# EAGLE design board (EAGLE 9.5.2)

## Sheet 1 of 4: MCU and Motors
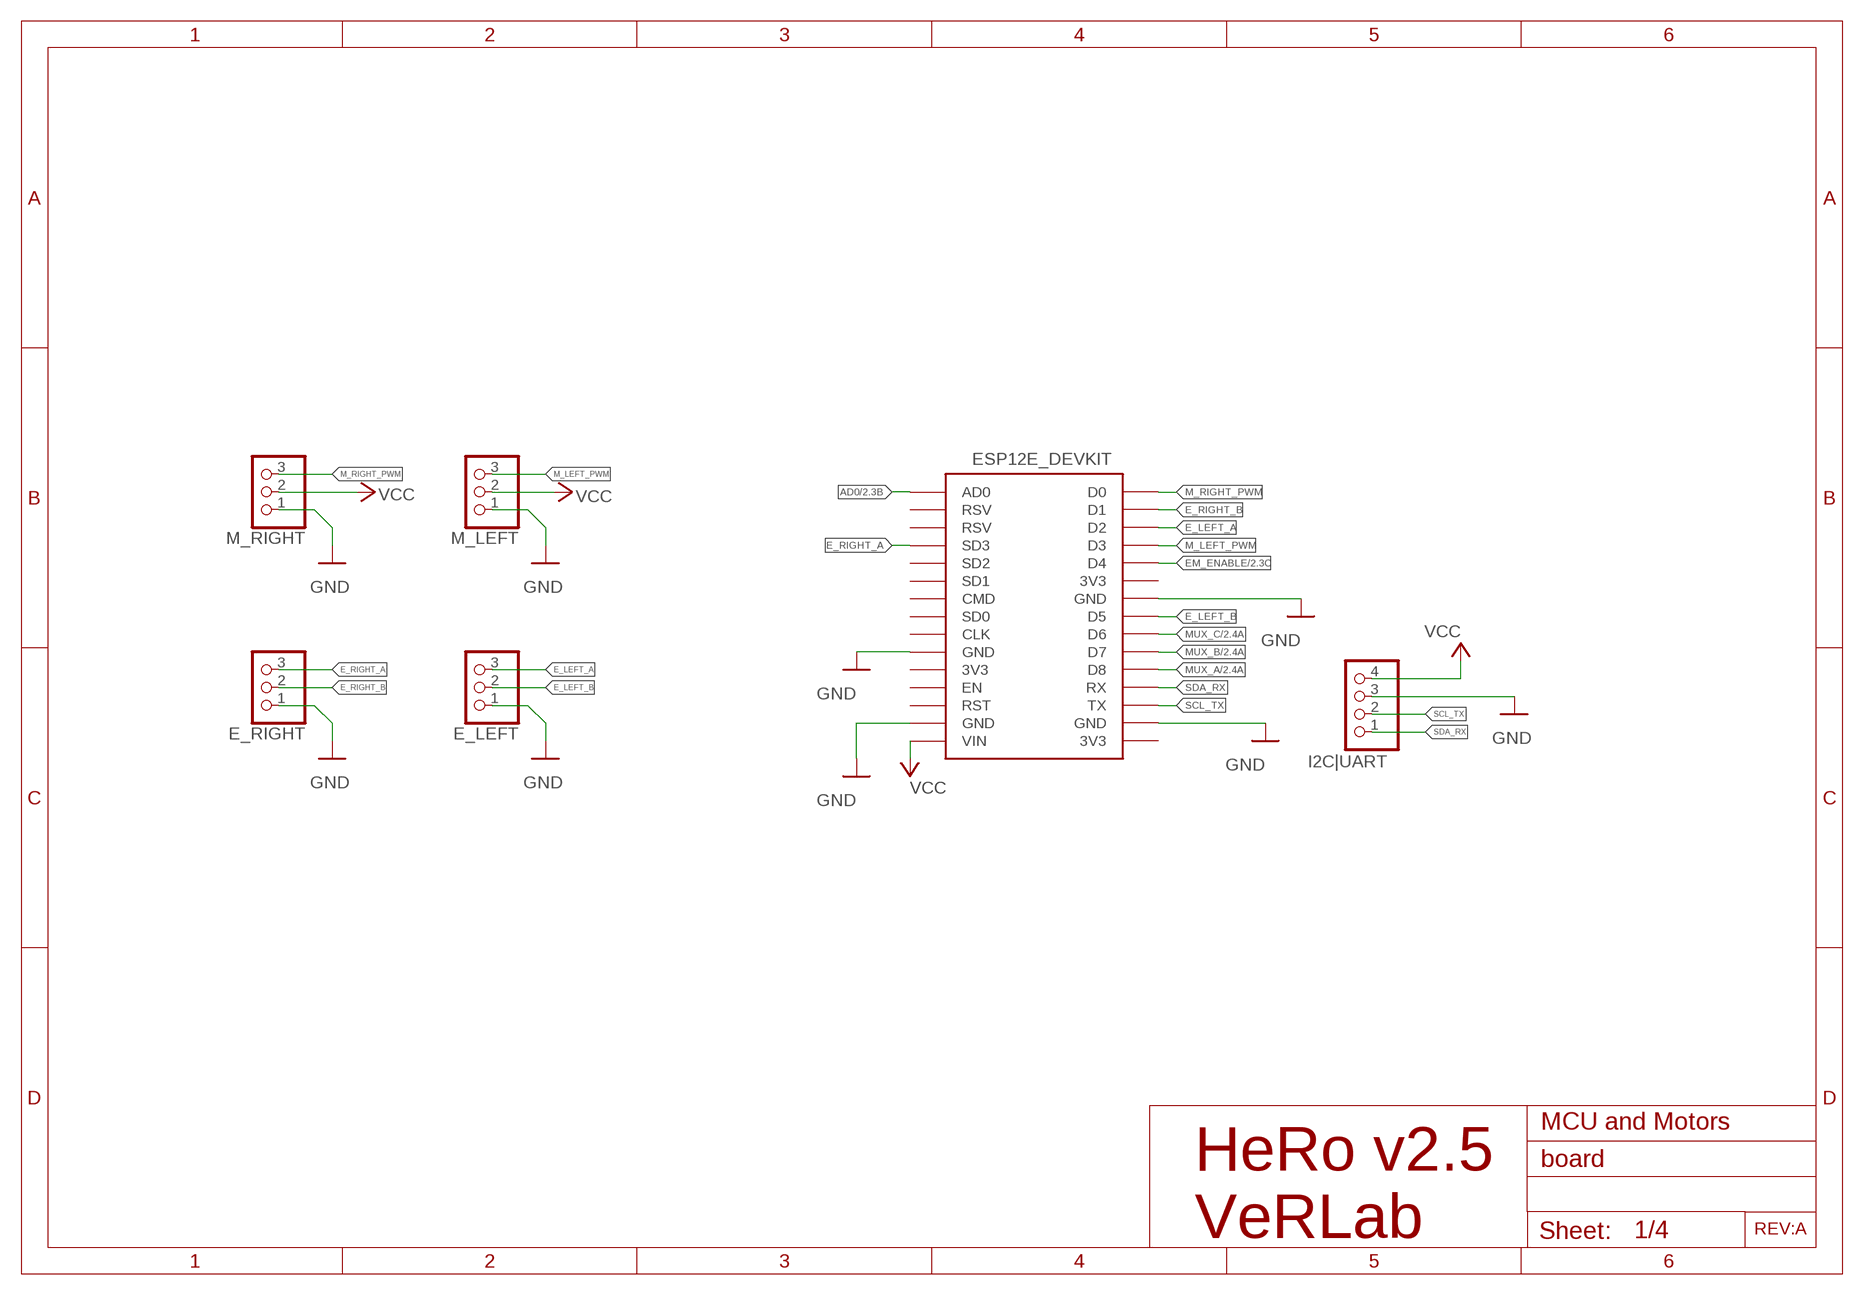
[diagram p0: schematic, sheet 1]
FRAME2 (A4L-LOC): TITLE: MCU and Motors

### Parts
E_LEFT  PINHD-1X3  [1X03]
E_RIGHT  PINHD-1X3  [1X03]
I2C|UART  PINHD-1X4  [1X04]
M_LEFT  PINHD-1X3  [1X03]
M_RIGHT  PINHD-1X3  [1X03]
U$1  ESP12E_DEVKIT  [ESP12E_DEVKIT]

### Nets
AD0: U$1.AD0 ; also sheet 2
E_LEFT_A: E_LEFT.3 U$1.D2
E_LEFT_B: E_LEFT.2 U$1.D5
E_RIGHT_A: E_RIGHT.3 U$1.SD3
E_RIGHT_B: E_RIGHT.2 U$1.D1
EM_ENABLE: U$1.D4 ; also sheet 2,3
GND: E_LEFT.1 E_RIGHT.1 I2C|UART.3 M_LEFT.1 M_RIGHT.1 U$1.GND@0(GND) U$1.GND@1(GND) U$1.GND@2(GND) U$1.GND@3(GND) ; also sheet 2,3,4
M_LEFT_PWM: M_LEFT.3 U$1.D3
M_RIGHT_PWM: M_RIGHT.3 U$1.D0
MUX_A: U$1.D8 ; also sheet 2
MUX_B: U$1.D7 ; also sheet 2
MUX_C: U$1.D6 ; also sheet 2
SCL_TX: I2C|UART.2 U$1.TX
SDA_RX: I2C|UART.1 U$1.RX
VCC: I2C|UART.4 M_LEFT.2 M_RIGHT.2 U$1.VIN ; also sheet 2,3,4
Unconnected: U$1.3V3@0(3V3) U$1.3V3@1(3V3) U$1.3V3@2(3V3) U$1.CLK U$1.CMD U$1.EN U$1.RST U$1.RSV@0(RSV) U$1.RSV@1(RSV) U$1.SD0 U$1.SD1 U$1.SD2

### Notes on the sheet
- REV:A
- HeRo v2.5
  VeRLab

## Sheet 2 of 4: Proximity Sensors
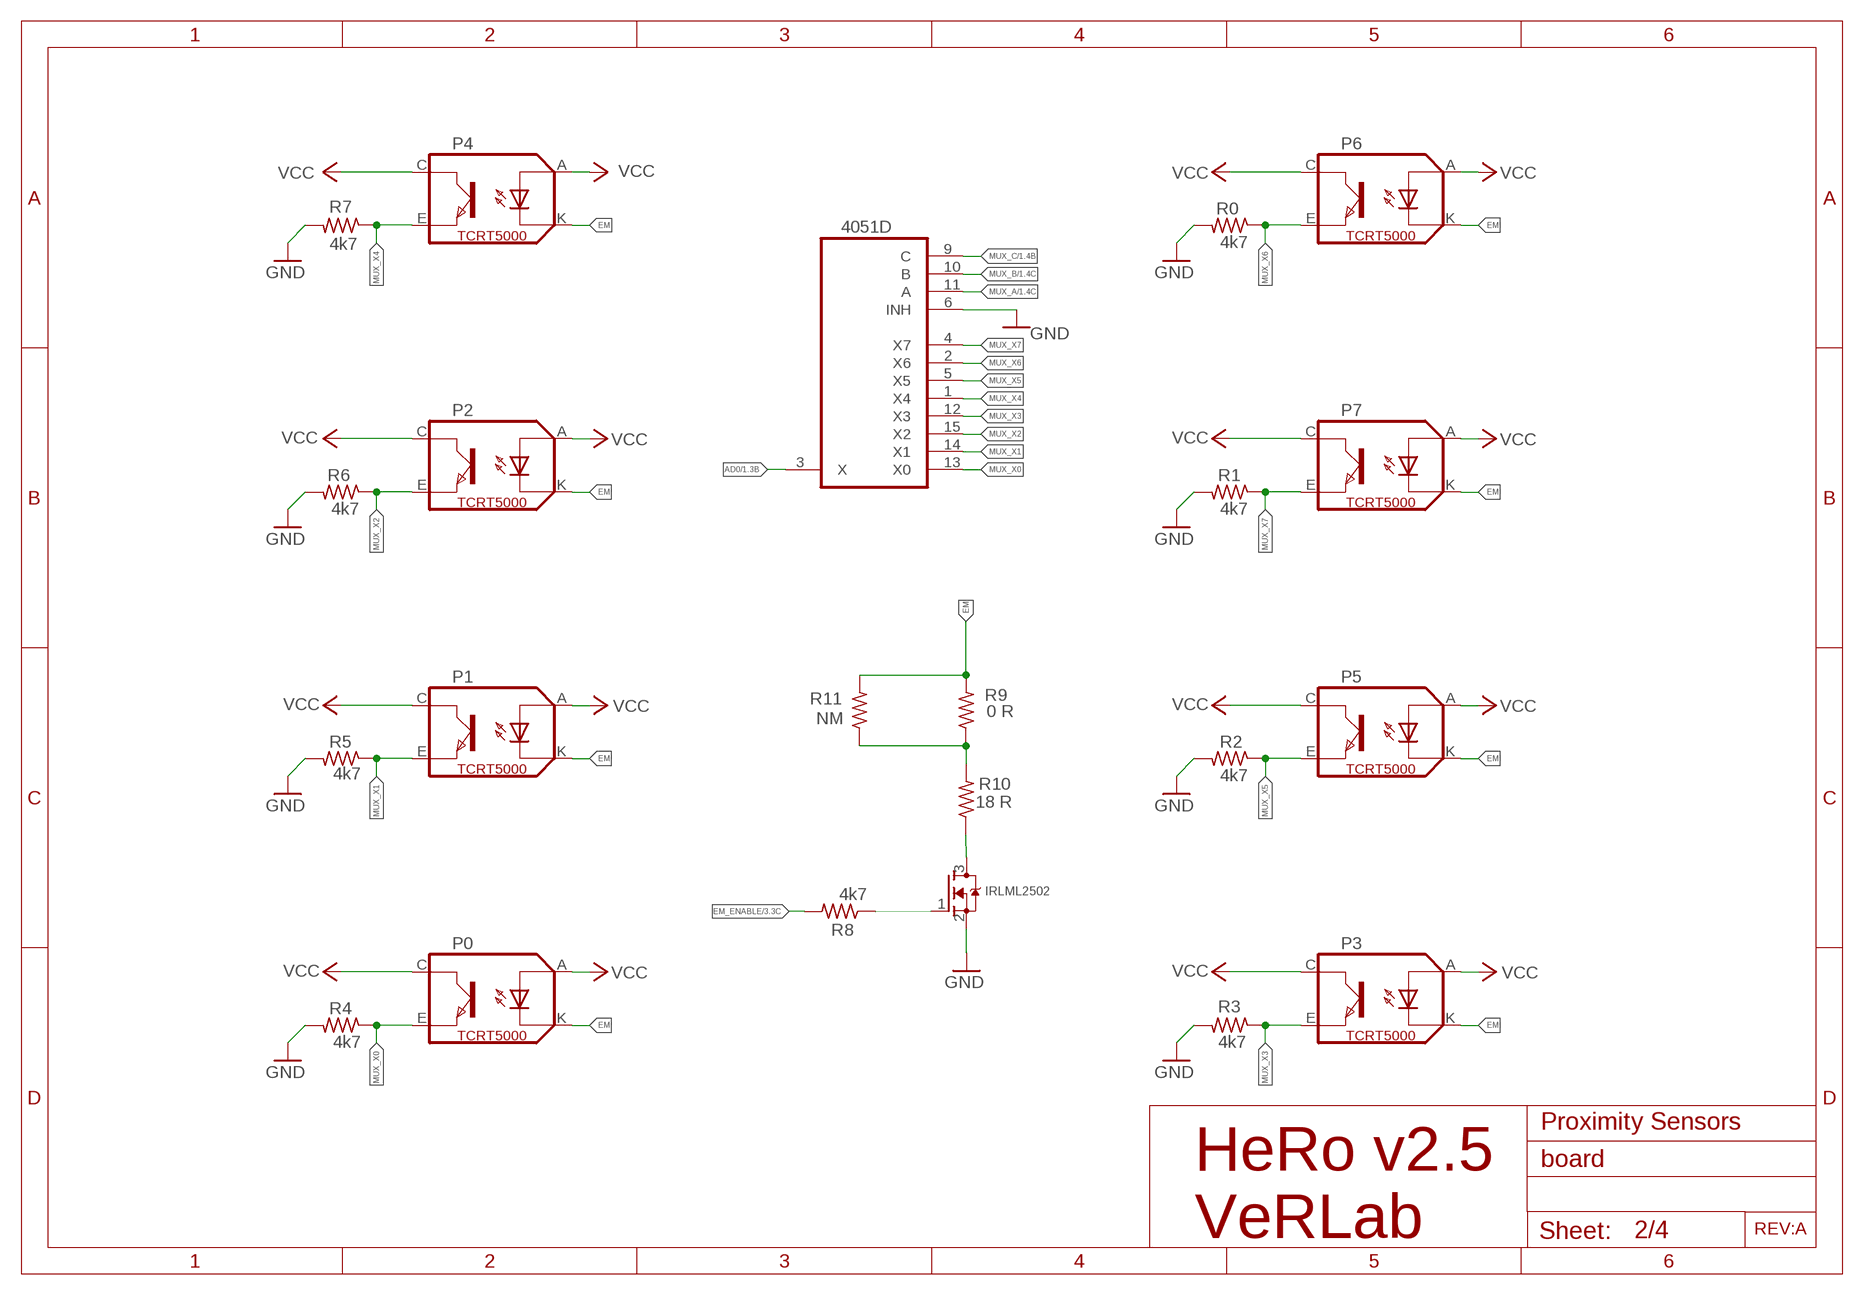
[diagram p1: schematic, sheet 2]
FRAME1 (A4L-LOC): TITLE: Proximity Sensors

### Parts
IC2  4051D  [SO16]
IRLML2502  MOSFET-NREFLOW  [SOT23]
P0  TCRT5000  [TCRT5000]
P1  TCRT5000  [TCRT5000]
P2  TCRT5000  [TCRT5000]
P3  TCRT5000  [TCRT5000]
P4  TCRT5000  [TCRT5000]
P5  TCRT5000  [TCRT5000]
P6  TCRT5000  [TCRT5000]
P7  TCRT5000  [TCRT5000]
R0  4k7  R-US_M0805  [M0805]
R1  4k7  R-US_M0805  [M0805]
R2  4k7  R-US_M0805  [M0805]
R3  4k7  R-US_M0805  [M0805]
R4  4k7  R-US_M0805  [M0805]
R5  4k7  R-US_M0805  [M0805]
R6  4k7  R-US_M0805  [M0805]
R7  4k7  R-US_M0805  [M0805]
R8  4k7  R-US_R0805  [R0805]
R9  0 R  R-US_R0805  [R0805]
R10  18 R  R-US_R0805  [R0805]
R11  NM  R-US_R0805  [R0805]

### Nets
AD0: IC2.3(X) ; also sheet 1
EM: P0.K(CATHODE) P1.K(CATHODE) P2.K(CATHODE) P3.K(CATHODE) P4.K(CATHODE) P5.K(CATHODE) P6.K(CATHODE) P7.K(CATHODE) R9.2 R11.2
EM_ENABLE: R8.2 ; also sheet 1,3
GND: IC2.6(INH) IRLML2502.2(S) R0.2 R1.2 R2.2 R3.2 R4.2 R5.2 R6.2 R7.2 ; also sheet 1,3,4
MUX_A: IC2.11(A) ; also sheet 1
MUX_B: IC2.10(B) ; also sheet 1
MUX_C: IC2.9(C) ; also sheet 1
MUX_X0: IC2.13(X0) P0.E(EMITTER) R4.1
MUX_X1: IC2.14(X1) P1.E(EMITTER) R5.1
MUX_X2: IC2.15(X2) P2.E(EMITTER) R6.1
MUX_X3: IC2.12(X3) P3.E(EMITTER) R3.1
MUX_X4: IC2.1(X4) P4.E(EMITTER) R7.1
MUX_X5: IC2.5(X5) P5.E(EMITTER) R2.1
MUX_X6: IC2.2(X6) P6.E(EMITTER) R0.1
MUX_X7: IC2.4(X7) P7.E(EMITTER) R1.1
N$3: IRLML2502.3(D) R10.1
N$4: R9.1 R10.2 R11.1
N$6: IRLML2502.1(G) R8.1
VCC: P0.A(ANODE) P0.C(COLLECTOR) P1.A(ANODE) P1.C(COLLECTOR) P2.A(ANODE) P2.C(COLLECTOR) P3.A(ANODE) P3.C(COLLECTOR) P4.A(ANODE) P4.C(COLLECTOR) P5.A(ANODE) P5.C(COLLECTOR) P6.A(ANODE) P6.C(COLLECTOR) P7.A(ANODE) P7.C(COLLECTOR) ; also sheet 1,3,4

### Notes on the sheet
- REV:A
- HeRo v2.5
  VeRLab

## Sheet 3 of 4: LED RGB
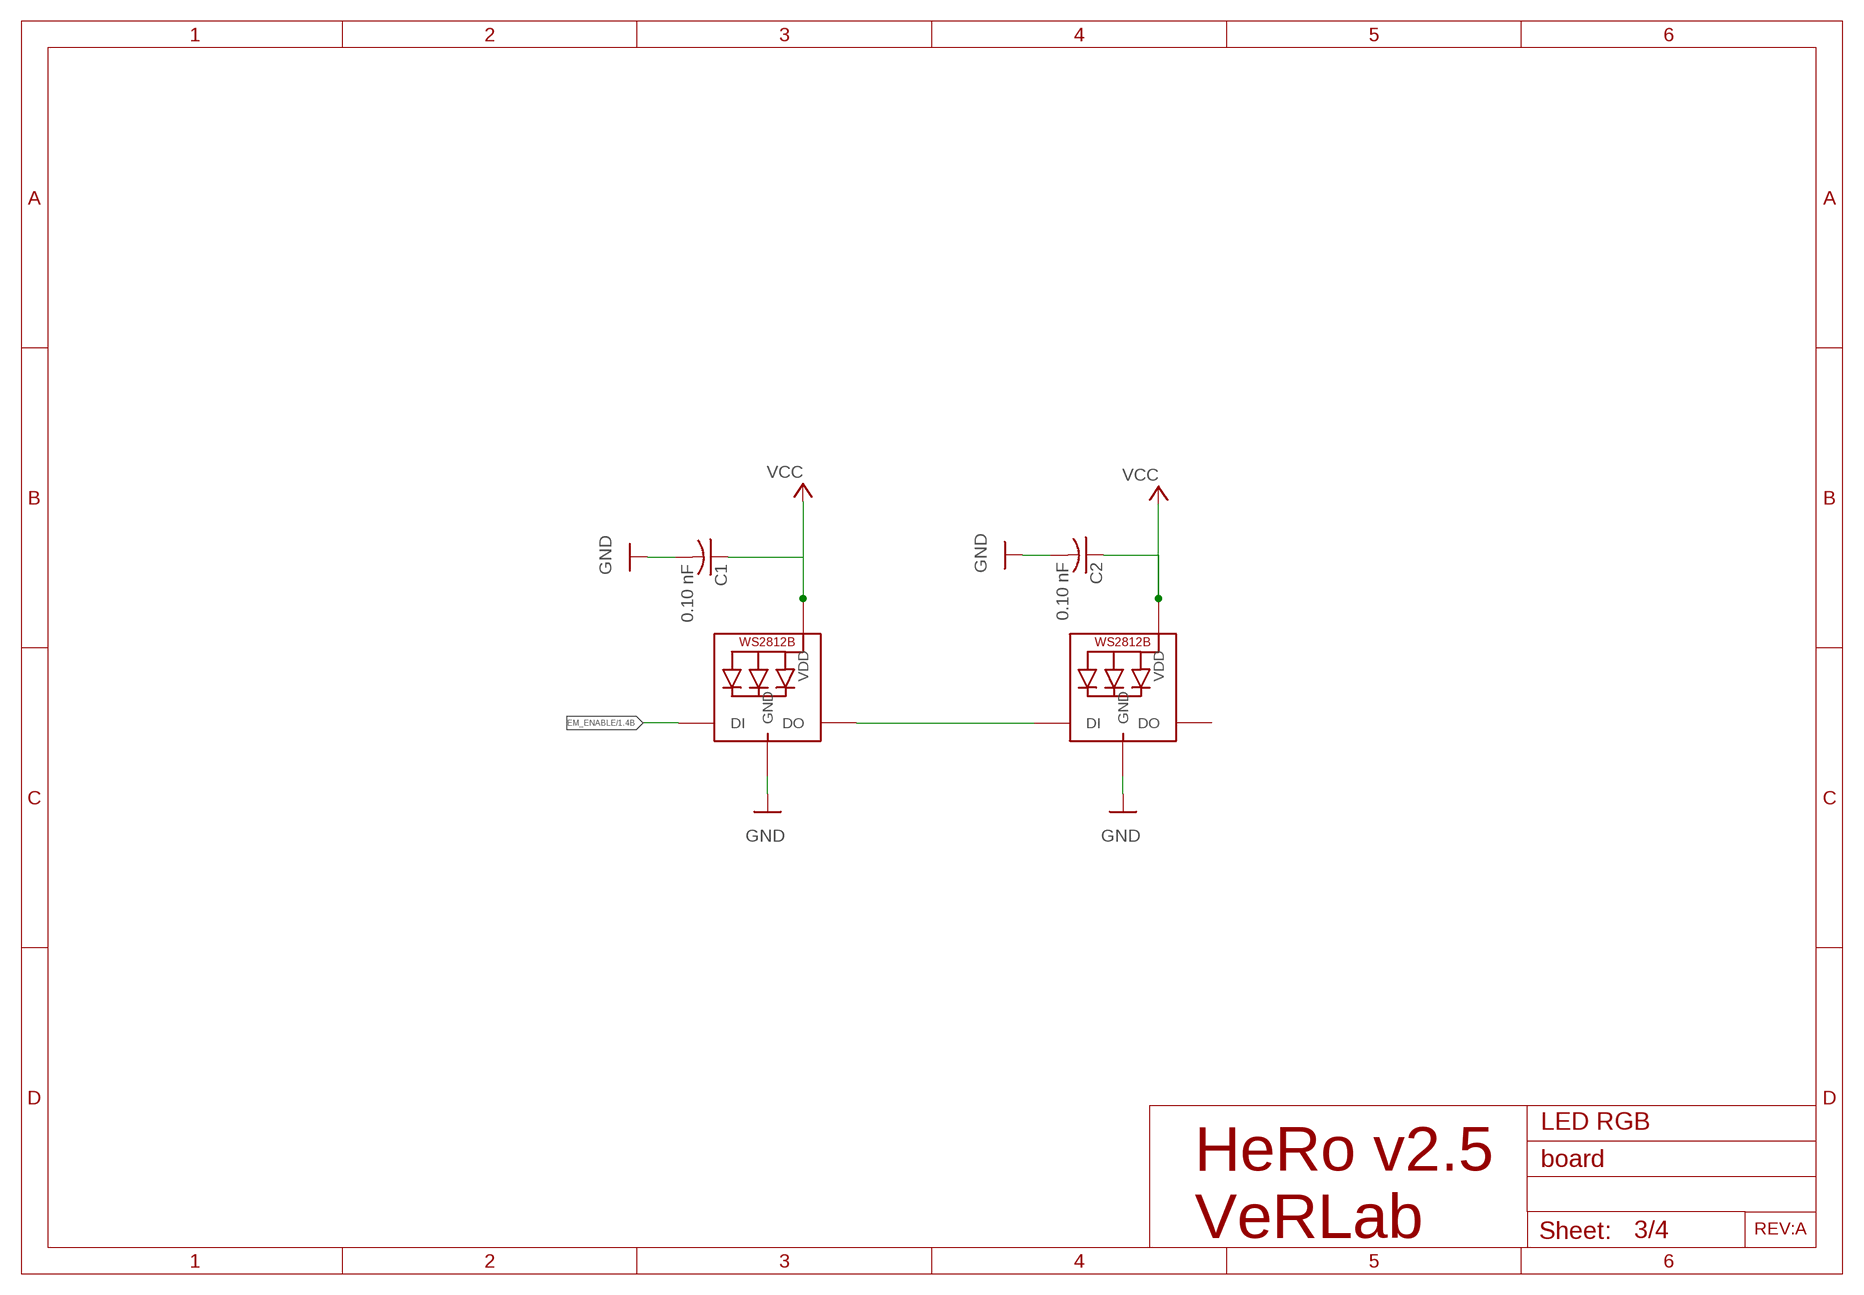
[diagram p2: schematic, sheet 3]
FRAME3 (A4L-LOC): TITLE: LED RGB

### Parts
C1  0.10 nF  C-USC0603  [C0603]
C2  0.10 nF  C-USC0603  [C0603]
LED0  WS2812B5050  [WS2812B]
LED1  WS2812B5050  [WS2812B]

### Nets
EM_ENABLE: LED0.4-DIN(DI) ; also sheet 1,2
GND: C1.2 C2.2 LED0.3-GND(GND) LED1.3-GND(GND) ; also sheet 1,2,4
VCC: C1.1 C2.1 LED0.1-VDD(VDD) LED1.1-VDD(VDD) ; also sheet 1,2,4
WS_OUT: LED0.2-DOUT(DO) LED1.4-DIN(DI)
Unconnected: LED1.2-DOUT(DO)

### Notes on the sheet
- REV:A
- HeRo v2.5
  VeRLab

## Sheet 4 of 4: Power Supply
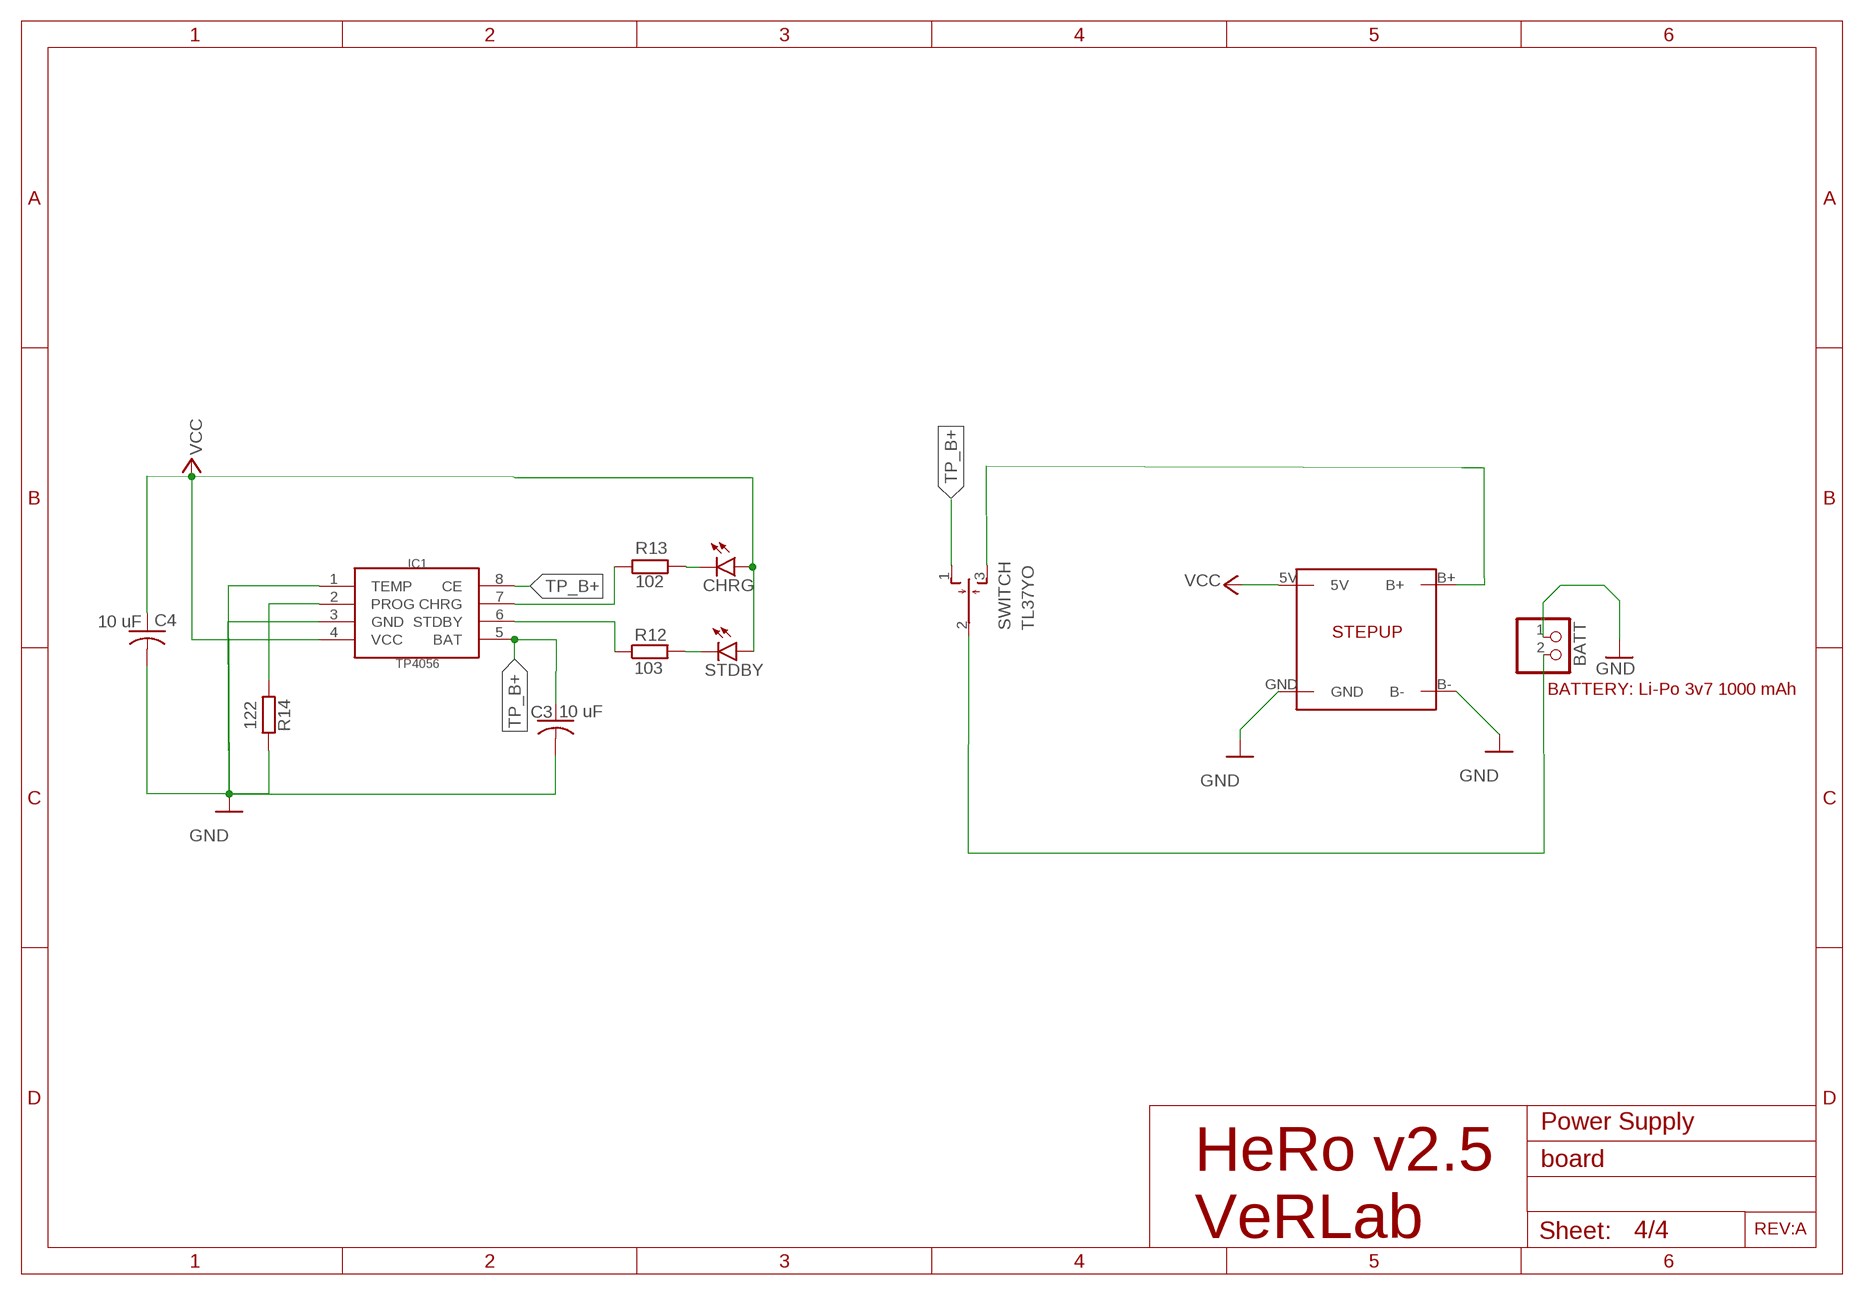
[diagram p3: schematic, sheet 4]
FRAME4 (A4L-LOC): TITLE: Power Supply

### Parts
BATT  PINHD-1X2  [1X02]
C3  10 uF  C-USC0603  [C0603]
C4  10 uF  C-USC0603  [C0603]
CHRG  LEDSML0805  [SML0805]
IC1  TP4056  [SOP-8]
OS1  STEPUP  [STEPUP]
R12  103  R-EU_R0805  [R0805]
R13  102  R-EU_R0805  [R0805]
R14  122  R-EU_R0603  [R0603]
STDBY  LEDSML0805  [SML0805]
SWITCH  TL37YO  [TL3XYO]

### Nets
B+: OS1.B+ SWITCH.3(S)
CHRG: IC1.7(CHRG) R13.1
GND: BATT.1 C3.2 C4.2 IC1.1(TEMP) IC1.3(GND) OS1.B- OS1.GND R14.1 ; also sheet 1,2,3
N$1: CHRG.A STDBY.A
N$2: BATT.2 SWITCH.2(P)
N$5: CHRG.C R13.2
N$8: R12.2 STDBY.C
PROG: IC1.2(PROG) R14.2
STDBY: IC1.6(STDBY) R12.1
TP_B+: C3.1 IC1.5(BAT) IC1.8(CE) SWITCH.1(O)
VCC: C4.1 IC1.4(VCC) OS1.5V ; also sheet 1,2,3

### Notes on the sheet
- BATTERY: Li-Po 3v7 1000 mAh
- REV:A
- HeRo v2.5
  VeRLab

## Power pins joined to a net without a drawn wire
GND: IC2.8(GND)
VCC: IC2.16(VCC)
VEE: IC2.7(VEE)

## Library data of the parts
BATT = pinhead:PINHD-1X2: PIN HEADER
C1 C2 = adafruit:C-US: CAPACITOR, American symbol
C3 C4 = resistor:C-US: CAPACITOR, American symbol
CHRG STDBY = led:LED: LED OSRAM: - CHIPLED LG R971, LG N971, LY N971, LG Q971, LY Q971, LO R971, LY R971 LH N974, LH R974 LS Q976, LO Q976, LY Q976 LO Q996 - Hyper CHIPLED LW Q18S LB Q993, LB Q99A, LB R99A - SideLED LS A670, LO A670, LY A670, LG A670, LP A670 LB A673, LV A673, LT A673, LW A673 LH A674 LY A675 LS A676, LA A676, LO A676, LY A676, LW A676 LS A679, LY A679, LG A679 - Hyper Micro SIDELED® LS Y876, LA Y876, LO Y876, LY Y876 LT Y87S - SmartLED LW L88C, LW L88S LB L89C, LB L89S, LG L890 LS L89K, LO L89K, LY L89K LS L896, LA L896, LO L896, LY L896 - TOPLED LS T670, LO T670, LY T670, LG T670, LP T670 LSG T670, LSP T670, LSY T670, LOP T670, LYG T670 LG T671, LOG T671, LSG T671 LB T673, LV T673, LT T673, LW T673 LH T674 LS T676, LA T676, LO T676, LY T676, LB T676, LH T676, LSB T676, LW T676 LB T67C, LV T67C, LT T67C, LS T67K, LO T67K, LY T67K, LW E67C LS E67B, LA E67B, LO E67B, LY E67B, LB E67C, LV E67C, LT E67C LW T67C LS T679, LY T679, LG T679 LS T770, LO T770, LY T770, LG T770, LP T770 LB T773, LV T773, LT T773, LW T773 LH T774 LS E675, LA E675, LY E675, LS T675 LS T776, LA T776, LO T776, LY T776, LB T776 LHGB T686 LT T68C, LB T68C - Hyper Mini TOPLED® LB M676 - Mini TOPLED Santana® LG M470 LS M47K, LO M47K, LY M47K Source: http://www.osram.convergy.de LUXEON: - LUMILED® LXK2-PW12-R00, LXK2-PW12-S00, LXK2-PW14-U00, LXK2-PW14-V00 LXK2-PM12-R00, LXK2-PM12-S00, LXK2-PM14-U00 LXK2-PE12-Q00, LXK2-PE12-R00, LXK2-PE12-S00, LXK2-PE14-T00, LXK2-PE14-U00 LXK2-PB12-K00, LXK2-PB12-L00, LXK2-PB12-M00, LXK2-PB14-N00, LXK2-PB14-P00, LXK2-PB14-Q00 LXK2-PR12-L00, LXK2-PR12-M00, LXK2-PR14-Q00, LXK2-PR14-R00 LXK2-PD12-Q00, LXK2-PD12-R00, LXK2-PD12-S00 LXK2-PH12-R00, LXK2-PH12-S00 LXK2-PL12-P00, LXK2-PL12-Q00, LXK2-PL12-R00 Source: www.luxeon.com KINGBRIGHT: KA-3528ASYC Source: www.kingbright.com
E_LEFT E_RIGHT M_LEFT M_RIGHT = pinhead:PINHD-1X3: PIN HEADER
I2C|UART = pinhead:PINHD-1X4: PIN HEADER
IC1 = TP4056:TP4056; SPICEPREFIX: X
IC2 = 40xx:4051: 8-channel ANALOG MULTIPLEXER
IRLML2502 = adafruit:MOSFET-N: N-Channel Mosfet 2N7002E - 60V 260mA SOT23 [Digikey: 2N7002ET1GOSTR-ND] - REEL BSH103 - 30V 850mA SOT23 [Digikey: 568-5013-1-ND]
LED0 LED1 = adafruit:WS2812B
OS1 = stepup:STEPUP
P0 P1-P7 = tcrt5000:TCRT5000
R0 R1-R7 = adafruit:R-US_: RESISTOR, American symbol
R8-R11 = resistor:R-US_: RESISTOR, American symbol; SPICEPREFIX: R
R12-R14 = resistor:R-EU_: RESISTOR, European symbol
SWITCH = switch:TL37YO: TINY SWITCH MOM OFF MOM Source: http://www2.produktinfo.conrad.com/datenblaetter/700000-724999/705152-da-01-de-Subminiaturschalter_TL_36YO.pdf
U$1 = ESP12E_DEVKIT:ESP12E_DEVKIT: ESP12E DEVKIT BOARD

## Net classes
0 default: width 0.508 mm, drill 0.508 mm, clearance 0.203 mm
1 gnd: width 0.508 mm, drill 0.508 mm, clearance 0.203 mm

## Board
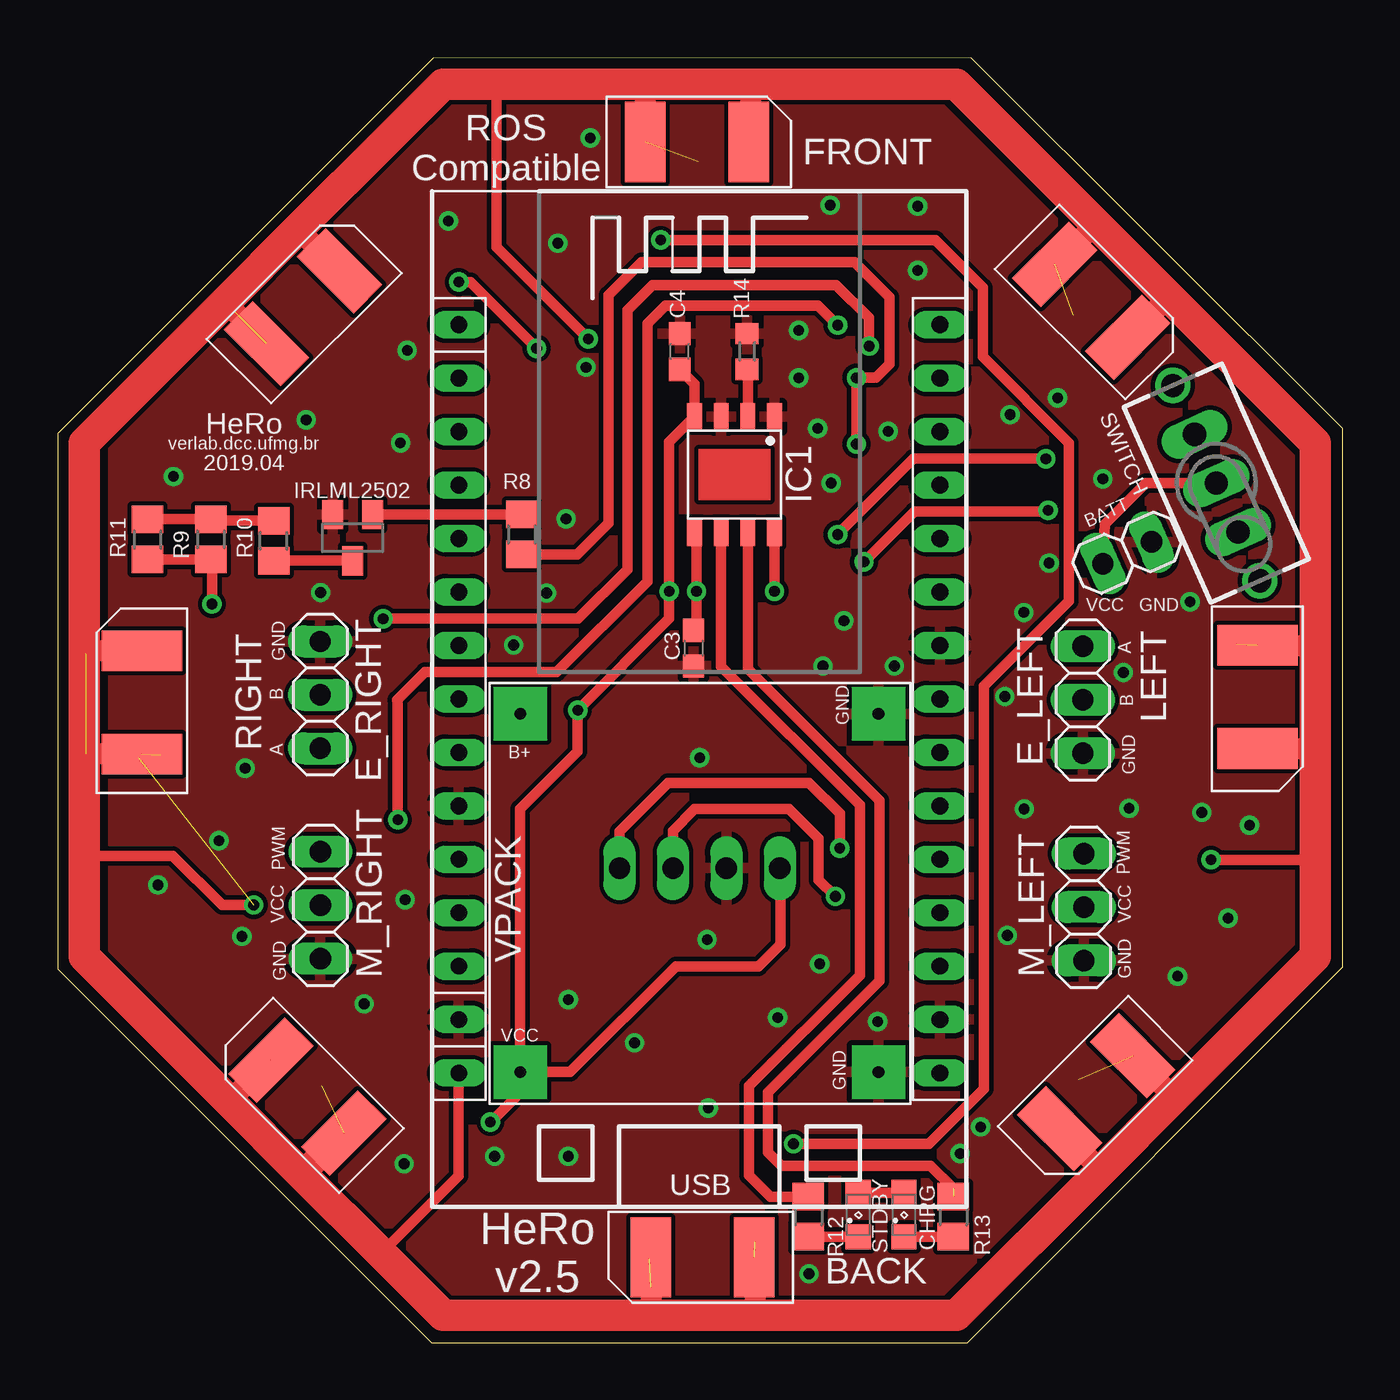
[diagram p4: board, top side]
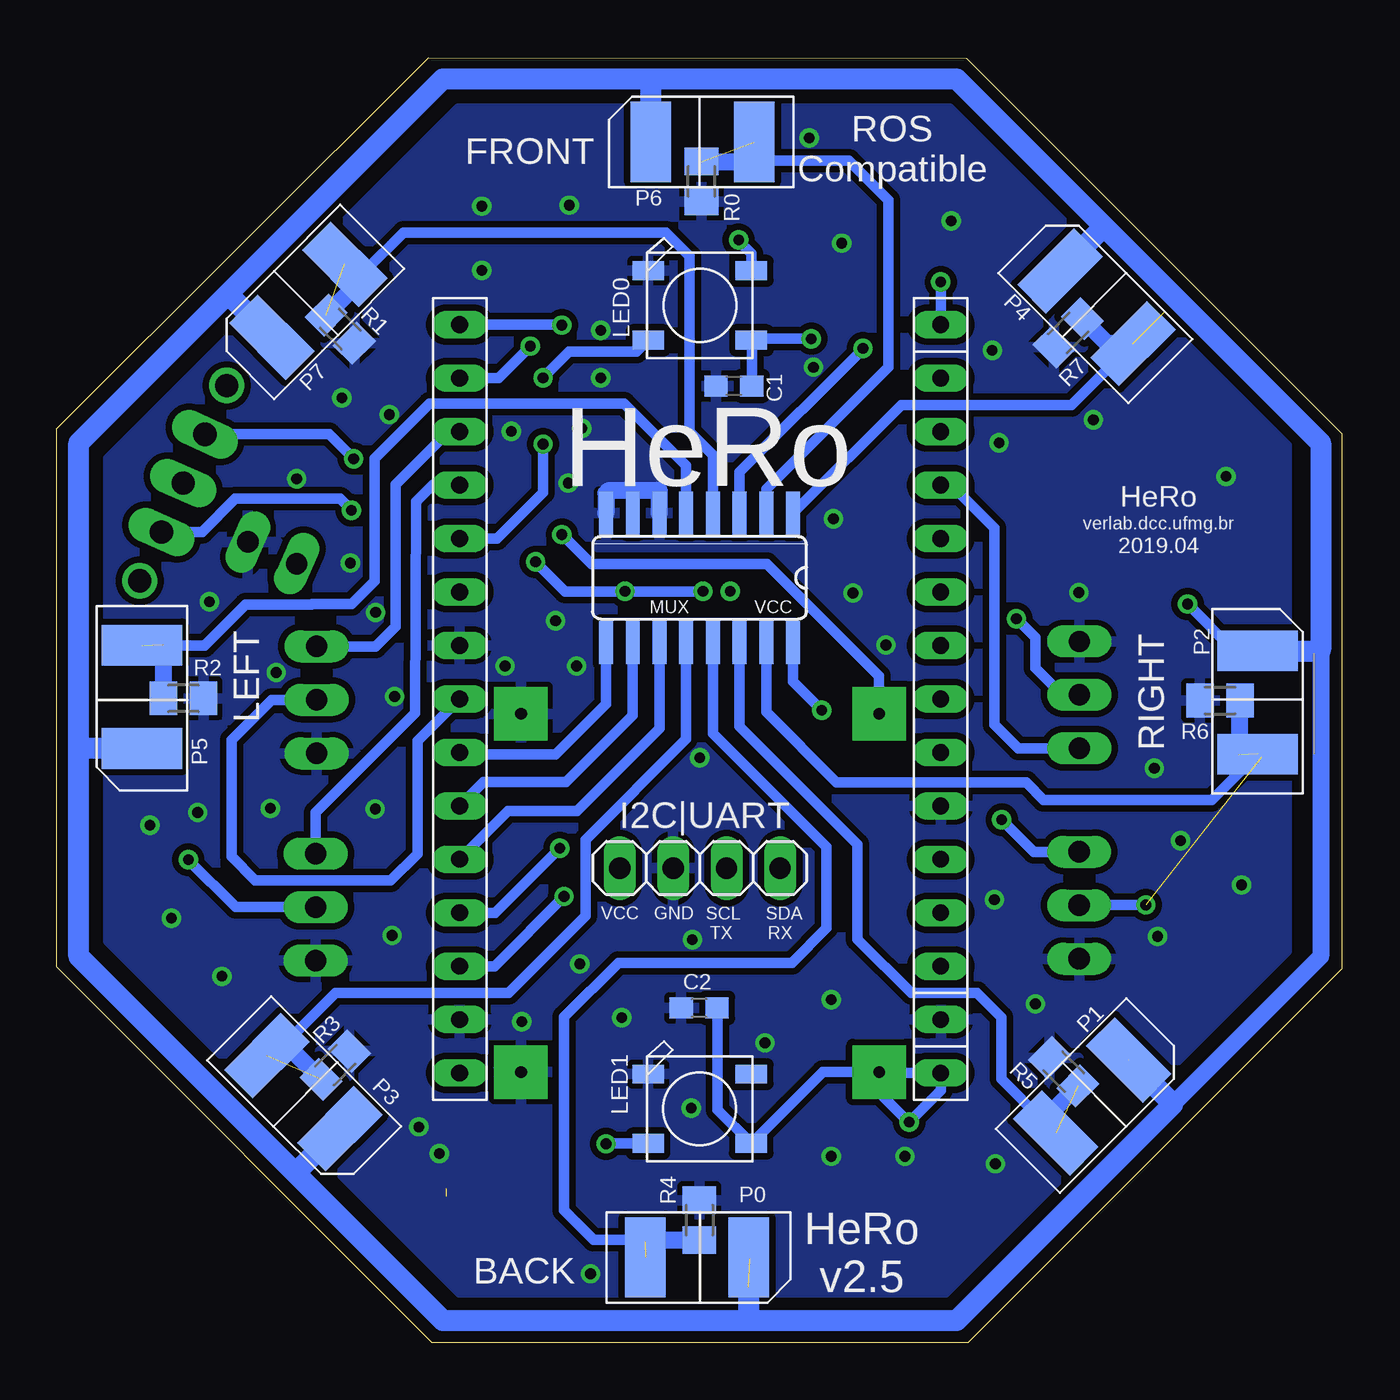
[diagram p5: board, bottom side, seen from below]

Size 61.06 x 61.06 mm. Coordinates in mm from the lower left corner, seen from the top.
Outline: 61.05,43.43 43.39,61.06 17.84,61.04 0,43.19 0,17.75 17.75,0 43.21,0 61.06,17.86 61.05,43.43
Copper layers (1*16): Top 0.035mm / dielectric 1.5mm / Bottom 0.035mm
Design rules "default": minimum track width 6mil, minimum drill 0.35mm, track to track 6mil, track to pad 6mil, pad to pad 6mil, via to via 6mil, smd to smd 6mil, copper to edge 40mil, drill to drill 6mil, minimum pad ring 10mil, minimum via ring 8mil, stop-mask expansion 4mil, vias tented up to drill 0mil, thermal gap 10mil

### Footprints (pad centres in the part's own frame; a part is rotated, then mirrored left to right if it is on the bottom)
1X02 = drill 1.016 long: 1 -1.27,0; 2 1.27,0
C0603 = smd 1.1 x 1: 1 -0.85,0; 2 0.85,0
SML0805 = smd 1.2 x 1.2: A 1.05,0; C -1.05,0
1X03 = drill 1.016 long: 1 -2.54,0; 2 0,0; 3 2.54,0
1X04 = drill 1.016 long: 1 -3.81,0; 2 -1.27,0; 3 1.27,0; 4 3.81,0
SOP-8 = smd 1.3 x 0.7: 1 -2.75,1.905; 2 -2.75,0.635; 3 -2.75,-0.635; 4 -2.75,-1.905; 5 2.75,-1.905; 6 2.75,-0.635; 7 2.75,0.635; 8 2.75,1.905
SO16 = smd 0.66 x 2.032: 1 -4.445,-3.073; 2 -3.175,-3.073; 3 -1.905,-3.073; 4 -0.635,-3.073; 5 0.635,-3.073; 6 1.905,-3.073; 7 3.175,-3.073; 8 4.445,-3.073; 9 4.445,3.073; 10 3.175,3.073; 11 1.905,3.073; 12 0.635,3.073; 13 -0.635,3.073; 14 -1.905,3.073; 15 -3.175,3.073; 16 -4.445,3.073
SOT23 = smd 1 x 1.4: 1 -0.95,-1.1; 2 0.95,-1.1; 3 0,1.1
WS2812B = smd 1.5 x 0.9: 1-VDD 2.45,-1.65; 2-DOUT 2.45,1.65; 3-GND -2.45,1.65; 4-DIN -2.45,-1.65
STEPUP = drill 0.55 pad 2.54 square: 5V -8.484,8.534; B+ 8.534,8.534; B- 8.534,-8.484; GND -8.484,-8.484
TCRT5000 = smd 1.93 x 3.81: A -2.311,0; C 2.591,0 | smd 1.93 x 3.81 bottom: E 2.591,0; K -2.311,0
M0805 = smd 1.3 x 1.6: 1 -0.95,0; 2 0.95,0
R0805 = smd 1.3 x 1.5: 1 -0.95,0; 2 0.95,0
R0603 = smd 1 x 1.1: 1 -0.85,0; 2 0.85,0
TL3XYO = drill 1.1 pad 1.422 long: 1 -2.54,0; 2 0,0; 3 2.54,0 | drill 1.1 pad 1.676: M1 -5.08,0; M2 5.08,0
ESP12E_DEVKIT = drill 0.8 pad 1.27 long: 3V3@0 -11.43,-7.62; 3V3@1 11.43,5.08; 3V3@2 11.43,-17.78; AD0 -11.43,17.78; CLK -11.43,-2.54; CMD -11.43,2.54; D0 11.43,17.78; D1 11.43,15.24; D2 11.43,12.7; D3 11.43,10.16; D4 11.43,7.62; D5 11.43,0; D6 11.43,-2.54; D7 11.43,-5.08; D8 11.43,-7.62; EN -11.43,-10.16; GND@0 -11.43,-5.08; GND@1 -11.43,-15.24; GND@2 11.43,2.54; GND@3 11.43,-15.24; RST -11.43,-12.7; RSV@0 -11.43,15.24; RSV@1 -11.43,12.7; RX 11.43,-10.16; SD0 -11.43,0; SD1 -11.43,5.08; SD2 -11.43,7.62; SD3 -11.43,10.16; TX 11.43,-12.7; VIN -11.43,-17.78

### Placement (x,y rotation side)
BATT  50.82,37.53 204 top
C1  28.88,45.46 180 bottom
C2  30.53,15.91 180 bottom
C3  30.2,33 270 top
C4  29.55,47.1 90 top
CHRG  40.2,6.08 90 top
E_LEFT  48.71,30.55 90 top
E_RIGHT  12.46,30.78 270 top
I2C|UART  30.5,22.55 180 bottom
IC1  32.15,41.25 270 top
IC2  30.51,36.34 180 bottom
IRLML2502  14,38.25 180 top
LED0  30.5,49.29 0 bottom
LED1  30.51,11.11 0 bottom
M_LEFT  48.75,20.7 90 top
M_RIGHT  12.47,20.79 90 top
OS1  30.51,21.35 90 top
P0  30.49,4.06 0 top
P1  11.75,11.79 315 top
P2  4,30.56 270 top
P3  49.24,11.8 45 top
P4  11.75,49.3 225 top
P5  57,30.55 90 top
P6  30.51,57.05 180 top
P7  49.21,49.41 135 top
R0  30.42,55.18 270 bottom
R1  47.58,48.16 315 bottom
R2  55.03,30.62 0 bottom
R3  47.82,13.18 45 bottom
R4  30.52,5.83 90 bottom
R5  13.21,12.87 135 bottom
R6  5.78,30.51 180 bottom
R7  12.99,47.98 225 bottom
R8  22.05,38.41 270 top
R9  7.27,38.18 270 top
R10  10.26,38.11 90 top
R11  4.26,38.17 270 top
R12  35.66,5.99 270 top
R13  42.55,6 270 top
R14  32.75,47.1 270 top
STDBY  38.03,6.08 90 top
SWITCH  55.05,40.84 114 top
U$1  30.48,30.59 0 top

### Tracks (layer width: path | path; a pad name or v marks a point on that pad's centre or on a via)
AD0  (via drill 0.51 pad 0.51)
  Top 0.508: v22.75,47.25 19.6,50.4 v19.05,50.4
  Bottom 0.508: IC2.3 28.61,41.37 22.75,47.22 v22.75,47.25 | U$1.AD0 v19.05,50.4
B+  (via drill 0.51)
  Top 0.508: v46.95,42 46.94,42.01 40.66,42.01 v37.05,38.4
  Bottom 0.508: SWITCH.3 48.11,43.16 v46.95,42 | OS1.B+ 21.98,31.67 27.3,37 35.65,37 v37.05,38.4
CHRG  (1 unrouted)
  Top 0.508: IC1.7 32.79,32.02 39.04,25.76 39.04,17.19 34.76,12.91 34.77,12.91 33.75,11.89 33.75,9.04 34.39,8.41 41.47,8.41 42.55,7.33
E_LEFT_A
  Bottom 0.508: U$1.D2 42.43,43.29 44.95,40.76 44.95,34.04 45.91,33.09 E_LEFT.3
E_LEFT_B
  Bottom 0.508: U$1.D5 43.92,28.58 43.92,23.23 45.18,21.97 51.62,21.97 52.75,23.1 52.75,28.65 50.85,30.55 E_LEFT.2
E_RIGHT_A
  Bottom 0.508: 18.54,40.75 16.49,38.7 16.49,29.38 15.35,28.24 E_RIGHT.3
  Bottom 0.813: U$1.SD3 18.54,40.75
E_RIGHT_B  (via drill 0.51 pad 0.51)
  Top 0.508: v15.45,34.4 | v15.45,34.4 24.73,34.4 27.07,36.74 27.07,49.07 28.26,50.26 36.97,50.26 38.53,48.7 38.53,47.37 v38.55,47.35
  Bottom 0.508: E_RIGHT.2 13.28,30.78 14.55,32.05 14.55,33.5 v15.45,34.4 | U$1.D1 40.07,45.83 v38.55,47.35
EM  (via drill 0.51)  (1 unrouted)
  Top 0.508: v7.32,35.1 7.32,37.18 R9.2 7.26,37.22 R11.2
  Bottom 0.508: 3.98,32.85 P2.K 5.09,32.87 v7.32,35.1
  Bottom 0.813: P2.K 1.06,32.87 1,32.93 1,18.35 8.03,11.32
  Bottom 1: 28.14,1.05 18.3,1.05 8.03,11.32 8.03,11.34 P1.K | 28.14,1.05 42.7,1.05 49.79,8.14 | 49.79,8.14 60,18.35 60,28.18 | 60,28.18 60,42.75 52.9,49.85 | 52.9,49.85 42.7,60.05 32.8,60.05 | 32.8,60.05 18.3,60.05 11.26,53 | 11.26,53 1,42.75 1,32.93 | P2.K 1.34,32.87 1.32,32.85 | P4.K 11.32,53 11.26,53 | P7.K 52.9,49.83 52.9,49.85 | P3.K 49.63,8.14 49.79,8.14 | P0.K 28.18,1.09 28.14,1.05 | P5.K 59.94,28.23 60,28.18 | P6.K 32.82,60.03 32.8,60.05
EM_ENABLE  (via drill 0.51 pad 0.51)
  Top 0.508: v37.95,42.7 v37.95,45.85 38.87,45.85 39.52,46.5 39.52,49.68 37.85,51.34 27.73,51.34 26.17,49.78 26.17,38.95 24.66,37.45 R8.2
  Bottom 0.508: U$1.D4 40.14,38.21 37.95,40.4 v37.95,42.7 | v37.95,45.85 36.72,47.09 33.5,47.09 LED0.4-DIN
GND  (via drill 0.51)
  Bottom 0.813: IC2.6 32.42,40.48 34.85,40.48 34.96,40.37 34.96,39.43 IC2.8
  other vias: 34.2,15.45 30.85,19.15 38.95,15.25 42.87,8.98 43.85,10.25 24.25,16.3 39.75,32.15 45.25,44.1 36.35,32.15 8.75,19.3 16.5,21.05 8.9,27.3 7.65,23.85 12.49,35.64 16.28,42.76 16.6,47.15 50.63,31.84 50.9,25.39 45.92,25.36 56.63,24.59 49.65,41.05 36.1,43.45 35.2,45.85 23.75,52.25 40.85,54 36.7,54.05 18.55,53.3 47.1,37.05 40.85,50.95 37.35,34.3 11.8,43.85 30.5,27.8 14.55,16.1 25.3,57.25 5.49,41.16 53.2,17.41 55.6,20.17 39.45,43.3 47.5,44.9 35.2,48.1 45.12,19.35 24.15,39.15 54.36,25.19 27.4,14.25 4.75,21.75 25.1,46.35 36.75,40.85 21.65,33.15 45,30.7 45.9,34.7 36.2,18 30.9,11.15 24.25,8.85 20.75,8.85 16.45,8.5 53.8,35.2 23.22,35.62 35.69,3.27
  pour Top: 18.81,2.42 41.95,2.42 58.63,19.1 58.63,41.98 41.95,58.66 18.66,58.66 2.62,42.62 2.62,18.6
  pour Bottom (isolate 0.305): 18.82,2.39 41.91,2.39 58.62,19.1 58.62,42 41.99,58.63 18.62,58.63 2.61,42.62 2.61,18.6
M_LEFT_PWM
  Bottom 0.508: U$1.D3 43.21,40.75 43.99,39.97 44.02,29.92 48.75,25.19 M_LEFT.3
M_RIGHT_PWM  (via drill 0.51 pad 0.51)
  Top 0.508: v37.05,48.35 36.13,49.28 28.88,49.28 28.02,48.42 28.02,36.18 23.7,31.86 17.45,31.86 16.13,30.54 16.15,30.52 v16.15,24.85
  Bottom 0.508: v37.05,48.35 37.07,48.37 U$1.D0 | M_RIGHT.3 14.63,23.33 v16.15,24.85
MUX_A
  Bottom 0.508: IC2.11 32.42,29.18 36.32,25.27 39.61,25.27 U$1.D8
MUX_B
  Bottom 0.508: U$1.D7 40.78,26.64 36.86,26.64 33.69,29.81 IC2.10
MUX_C
  Bottom 0.508: IC2.9 34.96,30.36 37.36,27.95 41.82,27.95
  Bottom 0.813: 41.82,27.95 U$1.D6
MUX_X0  (1 unrouted)
  Bottom 0.508: IC2.13 29.88,28.95 24.47,23.55 24.47,19.71 26.12,18.06 34.37,18.06 36.95,15.48 36.95,6.29 35.55,4.9 33.93,4.9 P0.E
  Bottom 0.813: R4.1 33.02,4.88 33.11,4.78
MUX_X1  (1 unrouted)
  Bottom 0.508: IC2.14 28.61,29.29 23,23.68 23,19.17 20.45,16.62 17.34,16.62 16.17,15.45 16.17,12.53 14.19,10.55
  Bottom 0.813: R5.1 14.19,10.55
MUX_X2  (1 unrouted)
  Bottom 0.508: R6.1 4.86,30.48 | IC2.15 27.34,29.96 24,26.62 14.99,26.62 14.17,25.8 6.16,25.8 P2.E
  Bottom 0.813: R6.1 4.89,30.45 4.84,30.4 4.84,27.97 4.89,27.92
MUX_X3  (1 unrouted)
  Bottom 0.508: IC2.12 31.15,28.68 35.93,23.9 35.93,20.28 39.59,16.62 47.8,16.62 50.2,14.22
  Bottom 0.813: 50.2,14.22 R3.1
MUX_X4
  Bottom 0.508: IC2.1 20.92,44.56 12.83,44.56 P4.E
  Bottom 0.813: P4.E 11.14,47.47 R7.1
MUX_X5  (1 unrouted)
  Bottom 0.508: 55.98,32.99 55.98,33.17 56,33.18 | IC2.5 31.15,41.67 34.09,44.62 43.33,44.62 45.95,42 45.95,36.2 47.05,35.1 48.92,35.1 48.94,35.07 52.08,35.07 54.02,33.14 P5.E
  Bottom 0.813: R2.1 55.98,33.17
MUX_X6  (1 unrouted)
  Bottom 0.508: 27.92,56.13 27.88,56.17 23.42,56.17 21.54,54.29 21.54,46.35 22.75,45.14 27.34,40.56 IC2.2
  Bottom 0.813: R0.1 27.92,56.13
MUX_X7  (1 unrouted)
  Bottom 0.508: 46.44,50.64 46.44,50.89 44.58,52.75 32.11,52.75 30.98,51.63 30.98,43.28 29.88,42.18 IC2.4
  Bottom 0.813: R1.1 46.44,50.64
N$1
  Top 0.508: STDBY.A CHRG.A
N$2
  Top 0.508: BATT.2 49.75,38.9 51.69,40.84 SWITCH.2
N$3
  Top 0.508: R10.1 IRLML2502.3
N$4
  Top 0.508: R10.2 7.35,39.06 R9.1 4.27,39.13 R11.1
N$5
  Top 0.508: CHRG.C 42.53,5.03 R13.2
N$6
  Top 0.508: IRLML2502.1 R8.1
N$8
  Top 0.508: R12.2 STDBY.C
PROG
  Top 0.508: IC1.2 32.79,46.22 R14.2
SCL_TX  (via drill 0.51)
  Top 0.508: I2C|UART.2 29.23,24.33 30.25,25.35 34.75,25.35 36.15,23.95 36.15,22 v36.95,21.2
  Bottom 0.508: U$1.TX 40.26,17.89 v36.95,21.2
SDA_RX  (via drill 0.51)
  Top 0.508: I2C|UART.1 26.69,24.29 29,26.6 35.7,26.6 37.15,25.15 v37.15,23.5
  Bottom 0.508: U$1.RX 40.22,20.43 v37.15,23.5
STDBY
  Top 0.508: IC1.6 31.52,32.14 38.1,25.55 38.1,17.45 32.85,12.2 32.85,7.94 33.85,6.94 R12.1
TP_B+  (via drill 0.51 pad 0.51)
  Top 0.508: IC1.5 30.35,38.4 v30.35,35.7 30.35,34 C3.1 | v47.05,39.55 46.99,39.49 40.69,39.49 v38.3,37.1 | v34.05,35.7 IC1.8
  Bottom 0.508: v30.35,35.7 v34.05,35.7 36.9,35.7 v38.3,37.1 | SWITCH.1 54.15,38.52 52.57,40.1 47.6,40.1 v47.05,39.55
VCC  (via drill 0.51, 0.51 pad 0.51)  (5 unrouted)
  Top 0.508: P0.C 33.08,4.06 | P0.A 28.19,4.06 | P5.C 57.12,33.26 | 57.07,28.3 P5.A | 8.42,48.98 8.42,49.16 | P2.A 3.93,32.8 | 3.82,27.8 P2.C | 28.18,2.62 28,2.45 | U$1.VIN 19.05,7.92 15.37,4.24 | 59.74,38.16 59.75,38.15 | 15.91,57.31 15.81,57.31 | 24.05,59.75 24,59.8 | OS1.5V 24.34,12.87 29.36,17.89 33.3,17.89 34.34,18.93 34.34,22.52 | v54.8,22.95 59.66,22.95 | v9.3,20.8 7.8,20.8 5.47,23.14 1.39,23.14 | v25.2,47.7 20.85,52.05 20.85,59.8 | IC1.4 30.25,43.7 | IC1.4 30.25,45.56 C4.1 | IC1.4 29.05,42.81 v29.05,35.7 29.05,34.4 v24.7,30.05 24.69,30.04 24.69,28.1 21.96,25.37 21.96,12.88 21.96,12.75 21.95,12.75 21.95,11.88 v20.55,10.48
  Top 0.813: 34.34,22.52 I2C|UART.4 | 21.96,12.88 OS1.5V 21.98,12.86 | 59.7,22.81 59.75,22.86
  Top 1: P2.A 1.37,32.87 1.32,32.82 1.32,32.75 | P2.C 1.34,27.97 1.33,27.97 | P1.A 8.27,11.58 8.03,11.58 | 11.63,8.01 11.59,8.01 | P3.A 49.55,8.22 49.55,8.15 | P3.C 53.03,11.67 53.03,11.63 | 57.05,28.28 P5.A 59.59,28.23 59.75,28.08 | 59.59,33.31 59.59,33.14 59.58,33.14 P5.C 59.71,33.14 59.75,33.09 | P7.A 52.78,49.71 52.79,49.71 | P7.C 49.2,53.06 49.44,53.06 | P6.A 32.93,57.17 32.93,59.8 | P6.C 27.92,59.61 28.11,59.8 | P4.A 11.45,52.88 11.38,52.88 | P4.C 8,49.39 8,49.5 | 28.11,3.98 P0.A 28.18,1.33 28.21,1.3 | P0.C 33.12,4.02 33.12,1.3
  Top 1.016: 59.66,22.95 59.75,22.86 | 1.39,23.14 1.25,23
  Top 1.27: 11.59,8.01 P1.C
  Top 1.5: 18.3,1.3 28.21,1.3 33.12,1.3 42.7,1.3 49.55,8.15 53.03,11.63 59.75,18.35 59.75,22.86 59.75,28.08 59.75,33.09 59.75,38.15 59.75,42.75 52.79,49.71 49.44,53.06 42.7,59.8 32.93,59.8 28.11,59.8 24,59.8 20.85,59.8 18.3,59.8 15.81,57.31 11.38,52.88 8,49.5 1.25,42.75 1.25,23 1.25,18.35 8.03,11.58 11.59,8.01 15.37,4.24 18.3,1.3
  Bottom 0.508: C1.1 28.03,47.62 27.95,47.7 v25.2,47.7 | OS1.5V 24.65,12.87 LED1.1-VDD 29.67,11.08 29.67,15.9 | M_LEFT.2 52.55,20.7 v54.8,22.95 | v24.7,30.05 26.07,31.41 IC2.16 | OS1.5V 21.92,12.81 U$1.VIN 19.05,11.98 v20.55,10.48 21.98,11.9 OS1.5V | v9.3,20.8 12.46,20.8 M_RIGHT.2
  Bottom 0.813: 29.67,15.9 C2.1 | 27.99,47.7 LED0.1-VDD 28.03,47.62
WS_OUT  (via drill 0.51, 0.51 pad 0.51)
  Top 0.508: v34.95,9.45 41.38,9.45 44,12.07 44,31.2 48.05,35.25 48.05,42.75 43.96,46.85 43.96,50.14 41.7,52.4 v28.65,52.4
  Bottom 0.508: LED1.4-DIN 34.94,9.46 v34.95,9.45 | LED0.2-DOUT 28.05,51.75 28.65,52.35 v28.65,52.4

### Text on the board
tPlace: verlab.dcc.ufmg.br
bPlace: HeRo | verlab.dcc.ufmg.br
tNames: ROS / Compatible | FRONT | HeRo | 2019.04 | VCC GND | RIGHT | LEFT | A | GND | B | B | GND | A | B+ | GND | PWM | PWM | VCC | VCC | GND | GND | VCC | GND | USB | HeRo / v2.5 | BACK
bNames: ROS / Compatible | FRONT | HeRo | 2019.04 | MUX VCC | RIGHT | LEFT | SCL SDA / TX RX | VCC GND | HeRo / v2.5 | BACK
tValues: RIGHT